# Altium schematic sheet Safety_2019_V_3_0_Connector_Filter.SchDoc
size B
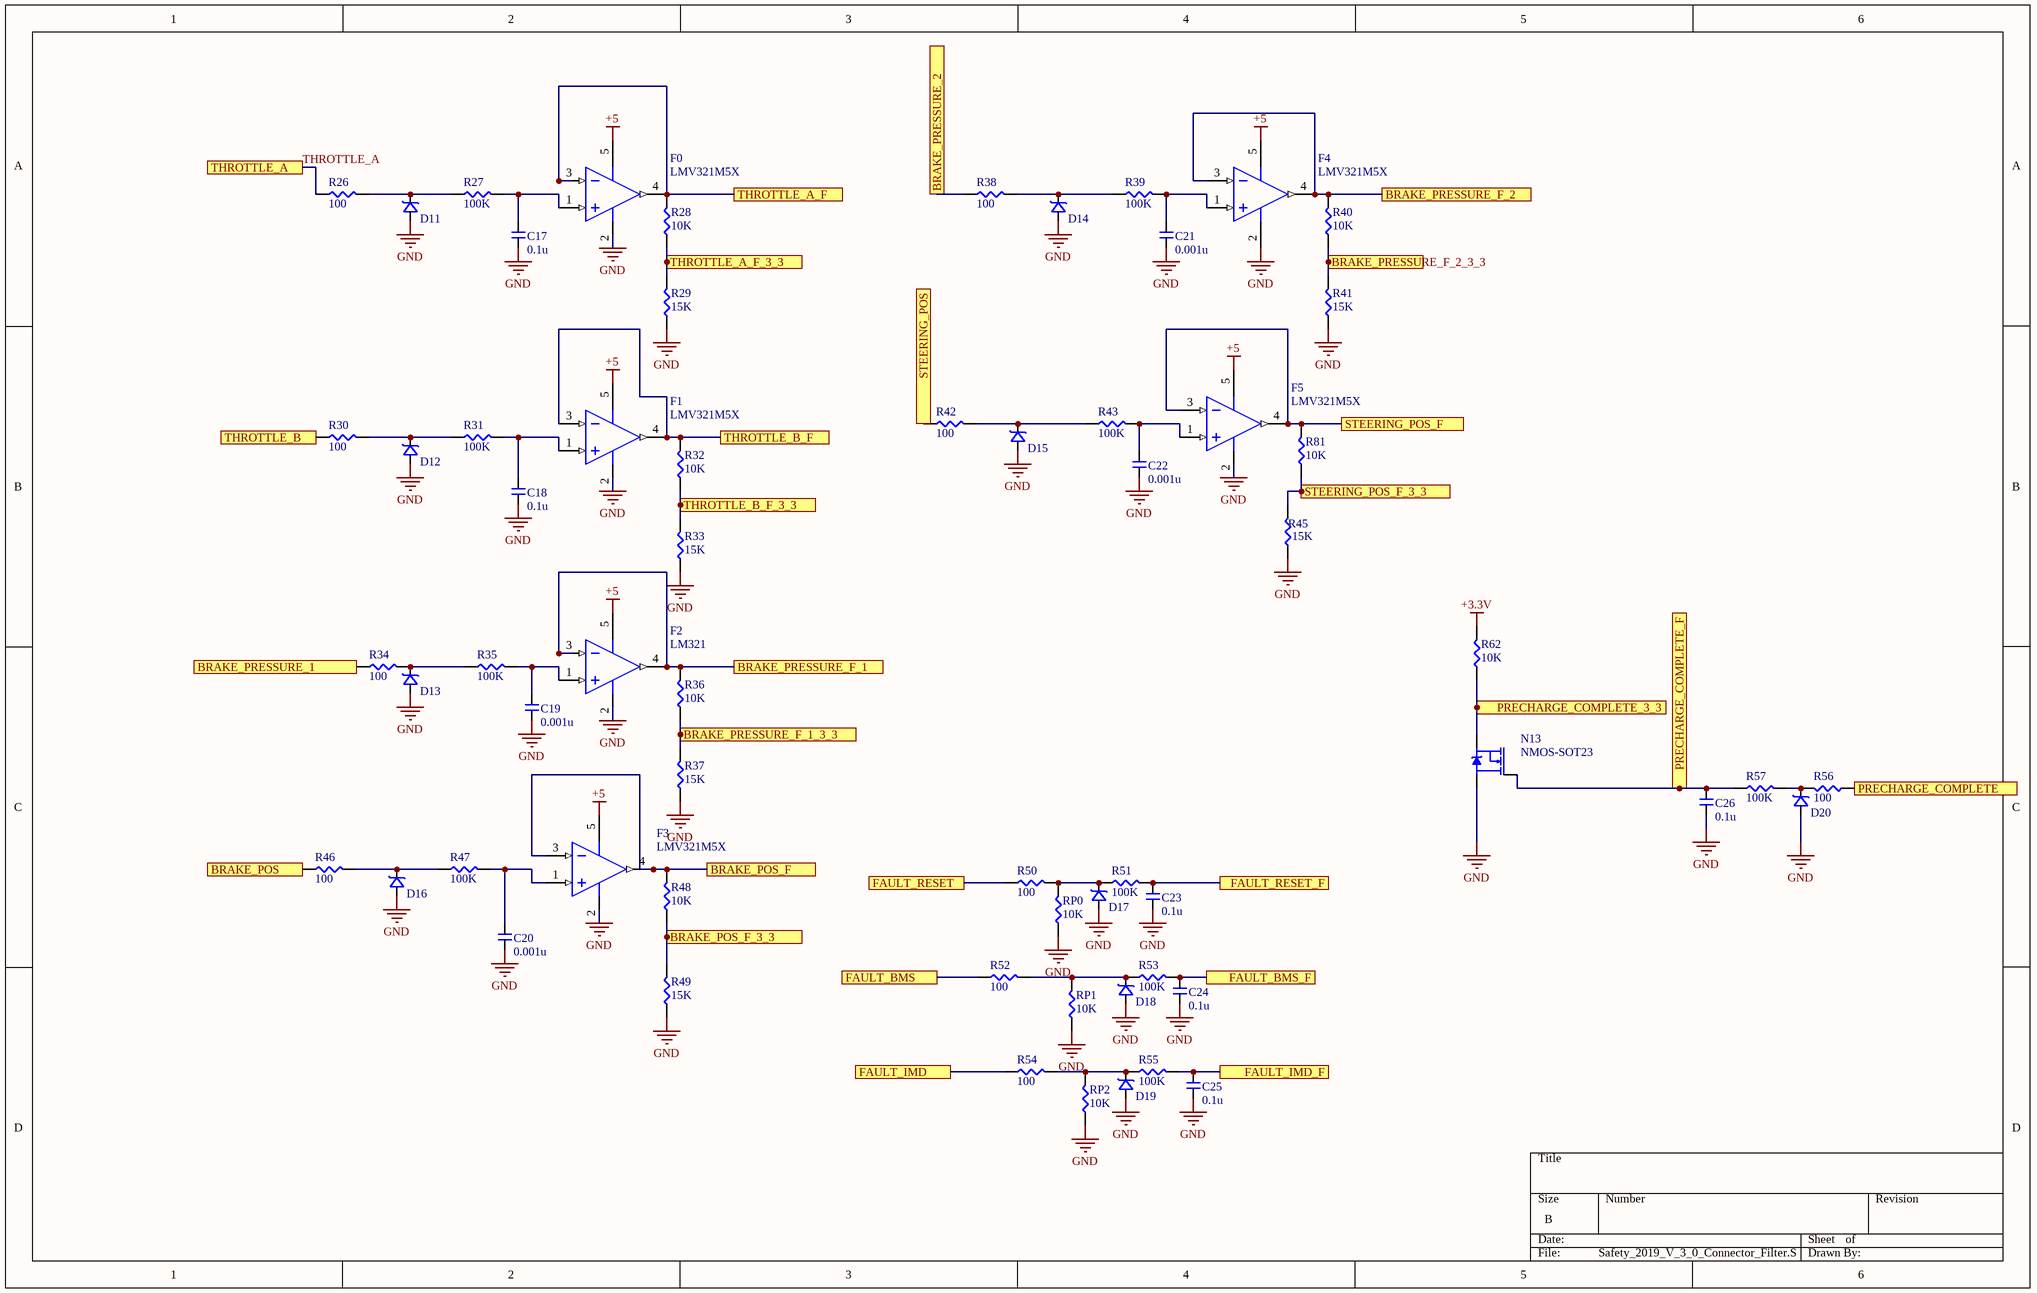
[diagram p0: Safety_2019_V_3_0_Connector_Filter.SchDoc]

## Parts
C17  0.1u  [CAP-0603]
C18  0.1u  [CAP-0603]
C19  0.001u  [CAP-0603]
C20  0.001u  [CAP-0603]
C21  0.001u  [CAP-0603]
C22  0.001u  [CAP-0603]
C23  0.1u  [CAP-0603]
C24  0.1u  [CAP-0603]
C25  0.1u  [CAP-0603]
C26  0.1u  [CAP-0603]
D11  ?  [SMB]  (value not drawn)
D12  ?  [SMB]  (value not drawn)
D13  ?  [SMB]  (value not drawn)
D14  ?  [SMB]  (value not drawn)
D15  ?  [SMB]  (value not drawn)
D16  ?  [SMB]  (value not drawn)
D17  ?  [SMB]  (value not drawn)
D18  ?  [SMB]  (value not drawn)
D19  ?  [SMB]  (value not drawn)
D20  ?  [SMB]  (value not drawn)
F0  LMV321M5X  [MF05A_N]
F1  LMV321M5X  [MF05A_N]
F2  LM321  [MF05A_N]
F3  LMV321M5X  [MF05A_N]
F4  LMV321M5X  [MF05A_N]
F5  LMV321M5X  [MF05A_N]
N13  NMOS-SOT23  [SOT23]
R26  100  [RES-0603]
R27  100K  [RES-0603]
R28  10K  [RES-0603]
R29  15K  [RES-0603]
R30  100  [RES-0603]
R31  100K  [RES-0603]
R32  10K  [RES-0603]
R33  15K  [RES-0603]
R34  100  [RES-0603]
R35  100K  [RES-0603]
R36  10K  [RES-0603]
R37  15K  [RES-0603]
R38  100  [RES-0603]
R39  100K  [RES-0603]
R40  10K  [RES-0603]
R41  15K  [RES-0603]
R42  100  [RES-0603]
R43  100K  [RES-0603]
R45  15K  [RES-0603]
R46  100  [RES-0603]
R47  100K  [RES-0603]
R48  10K  [RES-0603]
R49  15K  [RES-0603]
R50  100  [RES-0603]
R51  100K  [RES-0603]
R52  100  [RES-0603]
R53  100K  [RES-0603]
R54  100  [RES-0603]
R55  100K  [RES-0603]
R56  100  [RES-0603]
R57  100K  [RES-0603]
R62  10K  [RES-0603]
R81  10K  [RES-0603]
RP0  10K  [RES-0603]
RP1  10K  [RES-0603]
RP2  10K  [RES-0603]

## Ports
BRAKE_POS, BRAKE_POS_F, BRAKE_POS_F_3_3, BRAKE_PRESSURE_1, BRAKE_PRESSURE_2, BRAKE_PRESSURE_F_1, BRAKE_PRESSURE_F_1_3_3, BRAKE_PRESSURE_F_2, BRAKE_PRESSURE_F_2_3_3, FAULT_BMS, FAULT_BMS_F, FAULT_IMD, FAULT_IMD_F, FAULT_RESET, FAULT_RESET_F, PRECHARGE_COMPLETE, PRECHARGE_COMPLETE_3_3, PRECHARGE_COMPLETE_F, STEERING_POS, STEERING_POS_F, STEERING_POS_F_3_3, THROTTLE_A, THROTTLE_A_F, THROTTLE_A_F_3_3, THROTTLE_B, THROTTLE_B_F, THROTTLE_B_F_3_3

## Nets
+3.3V: R62.2
+5: F0.5(V+) F1.5(V+) F2.5(V+) F3.5(V+) F4.5(V+) F5.5(V+)
GND: C17.2 C18.2 C19.2 C20.2 C21.2 C22.2 C23.1 C24.1 C25.1 C26.1 D11.A D12.A D13.A D14.A D15.A D16.A D17.A D18.A D19.A D20.A F0.2(V-) F1.2(V-) F2.2(V-) F3.2(V-) F4.2(V-) F5.2(V-) N13.2(S) R29.1 R33.1 R37.1 R41.1 R45.1 R49.1 RP0.1 RP1.1 RP2.1
BRAKE_POS: R46.1 ; port BRAKE_POS
BRAKE_POS_F: F3.3(IN-) F3.4(OUT) R48.2 ; port BRAKE_POS_F
BRAKE_POS_F_3_3: R48.1 R49.2 ; port BRAKE_POS_F_3_3
BRAKE_PRESSURE_1: R34.1 ; port BRAKE_PRESSURE_1
BRAKE_PRESSURE_2: R38.1 ; port BRAKE_PRESSURE_2
BRAKE_PRESSURE_F_1: F2.3(IN-) F2.4(OUT) R36.2 ; port BRAKE_PRESSURE_F_1
BRAKE_PRESSURE_F_1_3_3: R36.1 R37.2 ; port BRAKE_PRESSURE_F_1_3_3
BRAKE_PRESSURE_F_2: F4.3(IN-) F4.4(OUT) R40.2 ; port BRAKE_PRESSURE_F_2
BRAKE_PRESSURE_F_2_3_3: R40.1 R41.2 ; port BRAKE_PRESSURE_F_2_3_3
FAULT_BMS: R52.1 ; port FAULT_BMS
FAULT_BMS_F: C24.2 R53.2 ; port FAULT_BMS_F
FAULT_IMD: R54.1 ; port FAULT_IMD
FAULT_IMD_F: C25.2 R55.2 ; port FAULT_IMD_F
FAULT_RESET: R50.1 ; port FAULT_RESET
FAULT_RESET_F: C23.2 R51.2 ; port FAULT_RESET_F
PRECHARGE_COMPLETE: R56.1 ; port PRECHARGE_COMPLETE
PRECHARGE_COMPLETE_3_3: N13.3(D) R62.1 ; port PRECHARGE_COMPLETE_3_3
PRECHARGE_COMPLETE_F: C26.2 N13.1(G) R57.1 ; port PRECHARGE_COMPLETE_F
STEERING_POS: R42.1 ; port STEERING_POS
STEERING_POS_F: F5.3(IN-) F5.4(OUT) R81.2 ; port STEERING_POS_F
STEERING_POS_F_3_3: R45.2 R81.1 ; port STEERING_POS_F_3_3
THROTTLE_A: R26.1 ; port THROTTLE_A
THROTTLE_A_F: F0.3(IN-) F0.4(OUT) R28.2 ; port THROTTLE_A_F
THROTTLE_A_F_3_3: R28.1 R29.2 ; port THROTTLE_A_F_3_3
THROTTLE_B: R30.1 ; port THROTTLE_B
THROTTLE_B_F: F1.3(IN-) F1.4(OUT) R32.2 ; port THROTTLE_B_F
THROTTLE_B_F_3_3: R32.1 R33.2 ; port THROTTLE_B_F_3_3
NetC17_1: C17.1 F0.1(IN+) R27.2
NetC18_1: C18.1 F1.1(IN+) R31.2
NetC19_1: C19.1 F2.1(IN+) R35.2
NetC20_1: C20.1 F3.1(IN+) R47.2
NetC21_1: C21.1 F4.1(IN+) R39.2
NetC22_1: C22.1 F5.1(IN+) R43.2
NetD11_K: D11.K R26.2 R27.1
NetD12_K: D12.K R30.2 R31.1
NetD13_K: D13.K R34.2 R35.1
NetD14_K: D14.K R38.2 R39.1
NetD15_K: D15.K R42.2 R43.1
NetD16_K: D16.K R46.2 R47.1
NetD17_K: D17.K R50.2 R51.1 RP0.2
NetD18_K: D18.K R52.2 R53.1 RP1.2
NetD19_K: D19.K R54.2 R55.1 RP2.2
NetD20_K: D20.K R56.2 R57.2

## Library data of the parts
C17-C26 = CAP-0603
D11-D20 = DIODE-SMB
F0-F5 = CMP-0055-01048-2: General Purpose, Low Voltage, Rail-to-Rail Output Operational Amplifiers, 5-pin SOT-23; Manufacturer: National Semiconductor; PackageTopMarking: A13*XTT; PowerWise: N; ComponentLink2URL: http://www.national.com/pf/LM/LMV321.html; ComponentLink1Description: LMV321 Datasheet; PackageReference: MF05A; ComponentLink3Description: MF05A Package Page; ComponentLink2Description: LMV321 Web Page; CompType: Amplifiers; ComponentLink1URL: http://www.national.com/ds/LM/LMV321.pdf; ComponentLink3URL: http://www.national.com/packaging/folders/mf05a.html; PinCount: 5; PackageDescription: Molded SOT-23, .115 x .063 x .040 in Body, 5 Lead, .0375 in Pitch; PackageVersion: revD, Aug-2008; RevisionNote: Component URLs added; DatasheetVersion: Sep-2009; RoHS: N
R26-R43 R45-R57 R62 R81 RP0-RP2 = RES-0603